# EAGLE board current stabiliser (EAGLE 8.3.2)
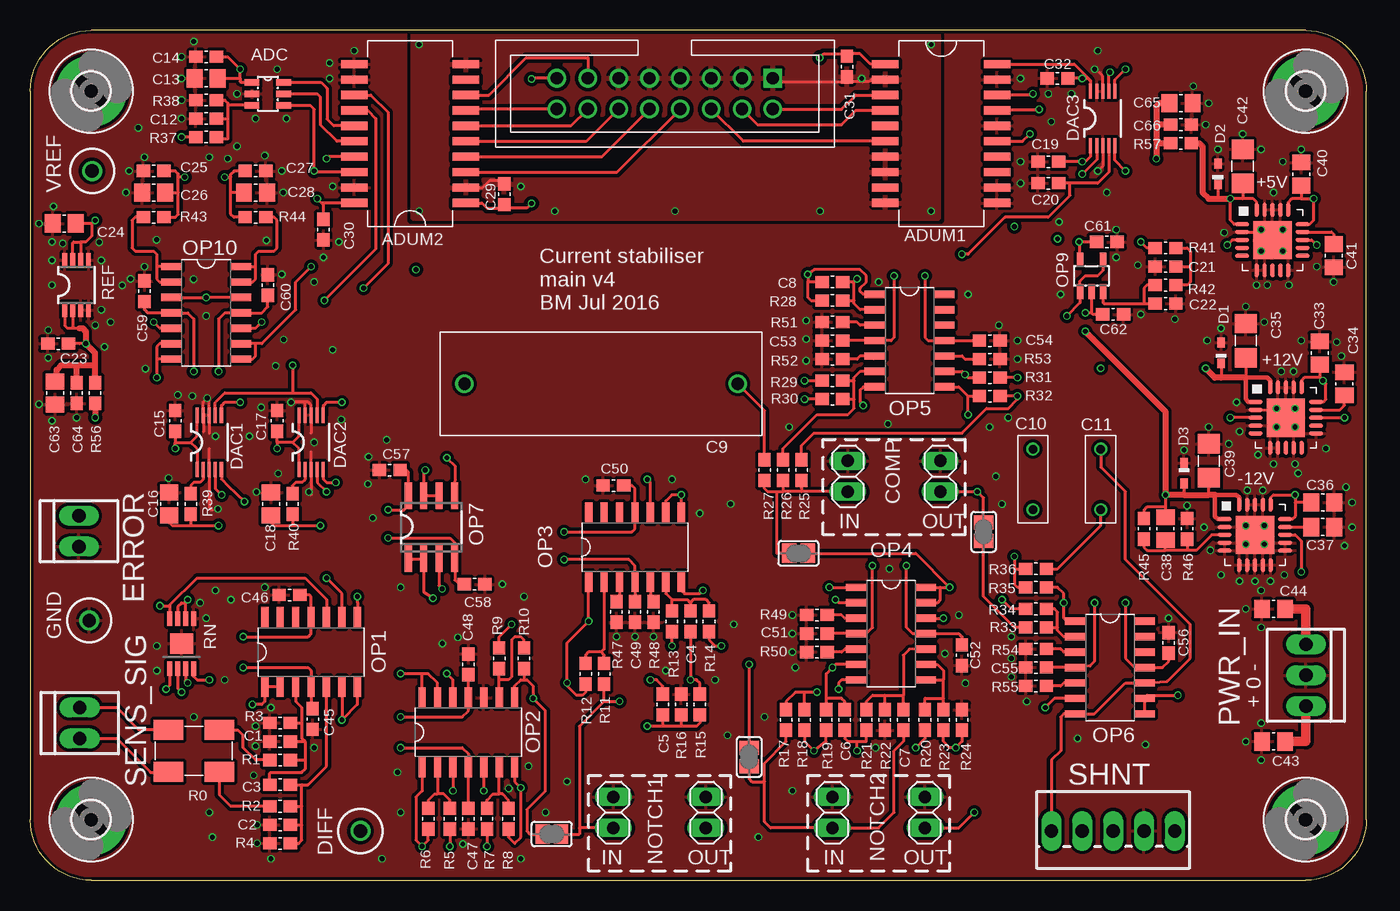
[diagram p12: board, top side]
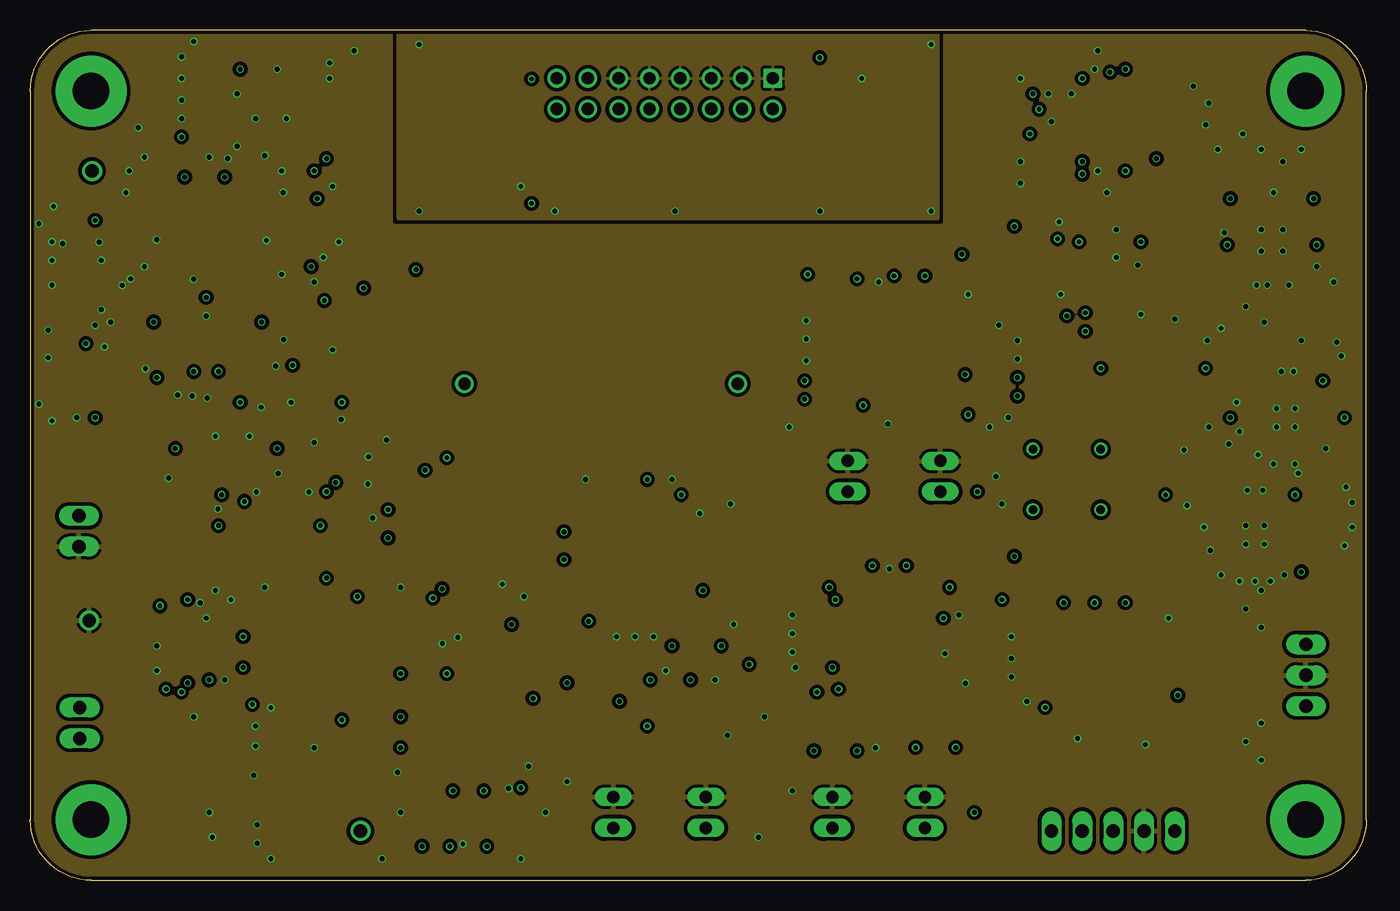
[diagram p13: board, inner layer ground]
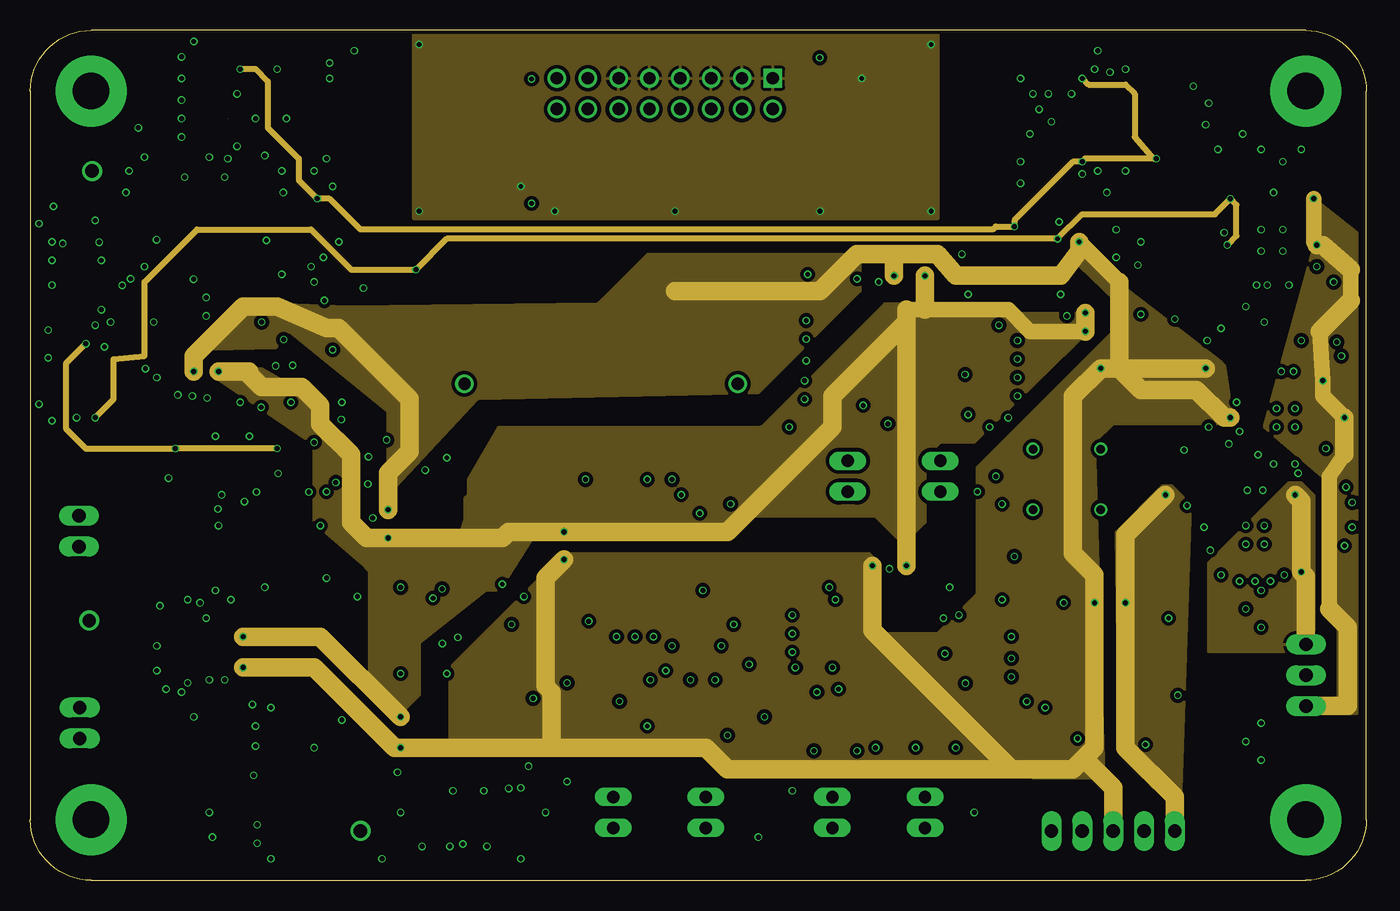
[diagram p14: board, inner layer power]
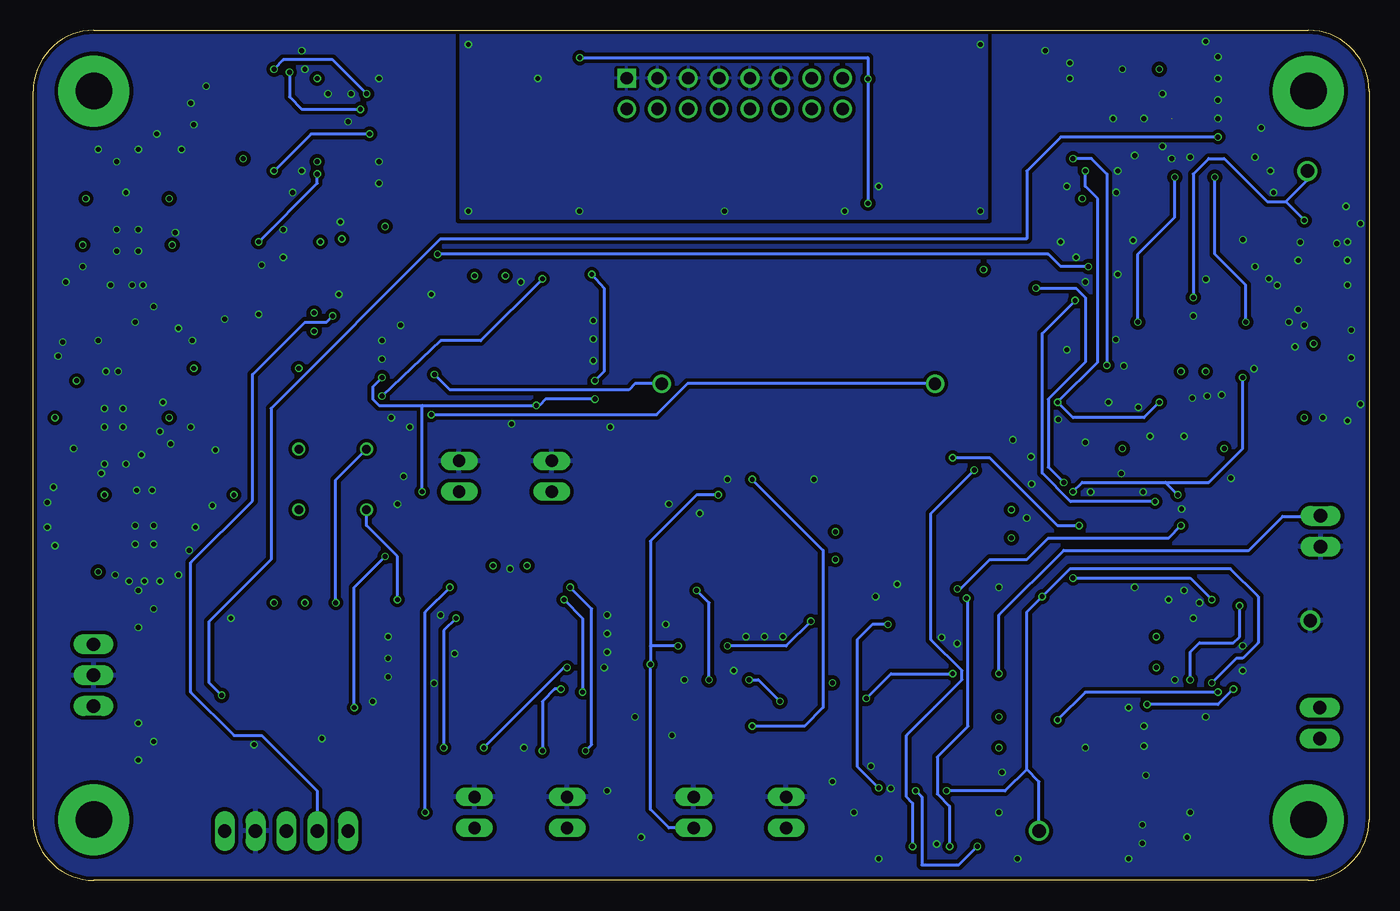
[diagram p15: board, bottom side, seen from below]

Size 110 x 70 mm. Coordinates in mm from the lower left corner, seen from the top.
Outline: 5,0 105,0 arc90 110,5 110,65 arc90 105,70 5,70 arc90 0,65 0,5 arc90 5,0
Copper layers (1*2*15*16): Top 0.035mm / dielectric 0.2mm / ground 0.0175mm / dielectric 0.3mm / power 0.0175mm / dielectric 0.2mm / Bottom 0.035mm
Design rules "SeeedStudio_4layer_DRU_no_angle_20140221": minimum track width 8mil, minimum drill 12mil, track to track 8mil, track to pad 8mil, pad to pad 8mil, via to via 8mil, smd to smd 0mil, copper to edge 10mil, drill to drill 8mil, minimum pad ring 6mil, minimum via ring 4mil, stop-mask expansion 4mil, vias tented up to drill 100mil, thermal gap 10mil

## Footprints (pad centres in the part's own frame; a part is rotated, then mirrored left to right if it is on the bottom)
QFN20_5 = smd 3.15 x 3.15: EP 0,0 | smd 1.175 x 0.35: P$1 -2.487,1.3; P$2 -2.487,0.65; P$3 -2.487,0; P$4 -2.487,-0.65; P$5 -2.487,-1.3; P$11 2.487,-1.3; P$12 2.487,-0.65; P$13 2.487,0; P$14 2.487,0.65; P$15 2.487,1.3 | smd 0.35 x 1.175: P$6 -1.3,-2.487; P$7 -0.65,-2.487; P$8 0,-2.487; P$9 0.65,-2.487; P$10 1.3,-2.487; P$16 1.3,2.487; P$17 0.65,2.487; P$18 0,2.487; P$19 -0.65,2.487; P$20 -1.3,2.487
SOT23-6 = smd 0.55 x 1.2: 1 -0.95,-1.3; 2 0,-1.3; 3 0.95,-1.3; 4 0.95,1.3; 5 0,1.3; 6 -0.95,1.3
SOIC_IC-20 = smd 2.2 x 0.6: 1 -4.6,5.715; 2 -4.6,4.445; 3 -4.6,3.175; 4 -4.6,1.905; 5 -4.6,0.635; 6 -4.6,-0.635; 7 -4.6,-1.905; 8 -4.6,-3.175; 9 -4.6,-4.445; 10 -4.6,-5.715; 11 4.6,-5.715; 12 4.6,-4.445; 13 4.6,-3.175; 14 4.6,-1.905; 15 4.6,-0.635; 16 4.6,0.635; 17 4.6,1.905; 18 4.6,3.175; 19 4.6,4.445; 20 4.6,5.715
0603 = smd 1.1 x 1: 1 -0.85,0; 2 0.85,0
CAP-26.5X8.5 = drill 1: P$1 -11.25,0; P$2 11.25,0
CAP-R82EC-7.2X2.5 = drill 0.7: P$1 -2.5,0; P$2 2.5,0
0805 = smd 1.3 x 1.5: 1 -0.95,0; 2 0.95,0
1206 = smd 1.6 x 1.8: 1 -1.4,0; 2 1.4,0
1X02 = drill 1.016 long: 1 -1.27,0; 2 1.27,0
SOD523 = smd 0.8 x 0.6: A 0.85,0; K -0.85,0
MSOP10_LONG = smd 0.25 x 1.25: 1 -1,-2.238; 2 -0.5,-2.238; 3 0,-2.238; 4 0.5,-2.238; 5 1,-2.238; 6 1,2.238; 7 0.5,2.238; 8 0,2.238; 9 -0.5,2.238; 10 -1,2.238
TESTPOINT = drill 1.1: P$1 0,0
MOLEX-2PIN = drill 1.1 long: 1 -1.27,0; 2 1.27,0
3,0-PAD = drill 3 pad 5.842: B3,0 0,0
SO14 = smd 1.7 x 0.6: P$1 -2.85,3.81; P$2 -2.85,2.54; P$3 -2.85,1.27; P$4 -2.85,0; P$5 -2.85,-1.27; P$6 -2.85,-2.54; P$7 -2.85,-3.81; P$8 2.85,-3.81; P$9 2.85,-2.54; P$10 2.85,-1.27; P$11 2.85,0; P$12 2.85,1.27; P$13 2.85,2.54; P$14 2.85,3.81
SO8 = smd 0.6 x 2.2: 1 -1.905,-2.6; 2 -0.635,-2.6; 3 0.635,-2.6; 4 1.905,-2.6; 5 1.905,2.6; 6 0.635,2.6; 7 -0.635,2.6; 8 -1.905,2.6
SOT23-5 = smd 0.55 x 1.2: 1 -0.95,-1.3; 2 0,-1.3; 3 0.95,-1.3; 4 0.95,1.3; 5 -0.95,1.3
MOLEX-3PIN = drill 1.1 long: 1 -2.54,0; 2 0,0; 3 2.54,0
VCS1625Z = smd 2.41 x 1.65: P$1 -2.095,1.715; P$2 -2.095,-1.715; P$3 2.095,1.715; P$4 2.095,-1.715
MSOP8 = smd 0.4 x 1.2: 1 -0.975,-2.05; 2 -0.325,-2.05; 3 0.325,-2.05; 4 0.975,-2.05; 5 0.975,2.05; 6 0.325,2.05; 7 -0.325,2.05; 8 -0.975,2.05
MSOP8-EP = smd 0.4 x 1.2: 1 -0.975,-2.05; 2 -0.325,-2.05; 3 0.325,-2.05; 4 0.975,-2.05; 5 0.975,2.05; 6 0.325,2.05; 7 -0.325,2.05; 8 -0.975,2.05 | smd 1.88 x 1.68: EP 0,0
MOLEX-KK-5PIN = drill 1.1 long: 1 -5.08,0; 2 -2.54,0; 3 0,0; 4 2.54,0; 5 5.08,0
SJ = smd 1.168 x 1.6: 1 -0.762,0; 2 0.762,0
HEADER-2X8-BOX = drill 1.02 square: 1 -8.89,-1.27 | drill 1.02: 2 -8.89,1.27; 3 -6.35,-1.27; 4 -6.35,1.27; 5 -3.81,-1.27; 6 -3.81,1.27; 7 -1.27,-1.27; 8 -1.27,1.27; 9 1.27,-1.27; 10 1.27,1.27; 11 3.81,-1.27; 12 3.81,1.27; 13 6.35,-1.27; 14 6.35,1.27; 15 8.89,-1.27; 16 8.89,1.27

## Placement (x,y rotation side)
+5V  TPS7A4700  [QFN20_5]  102.27,52.73 0 top
+12V  TPS7A4700  [QFN20_5]  103.38,38.1 0 top
-12V  TPS7A33  [QFN20_5]  100.84,28.45 0 top
ADC  AD7477SOT23  [SOT23-6]  19.56,64.77 270 top
ADUM1  ADUM4151B  [SOIC_IC-20]  75,61.5 0 top
ADUM2  ADUM4151B  [SOIC_IC-20]  31.27,61.5 180 top
C1  4n7  [0603]  20.57,11.43 180 top
C2  4n7  [0603]  20.57,4.57 180 top
C3  47n  [0603]  20.57,7.87 0 top
C4  1n5  [0603]  54.36,21.34 270 top
C5  1n5  [0603]  52.07,14.48 270 top
C6  1n0  [0603]  67.06,13.21 270 top
C7  10n  [0603]  71.88,13.21 90 top
C8  470n  [0603]  66.04,49.28 180 top
C9  10u  [CAP-26.5X8.5]  46.99,40.89 180 top
C10  68n  [CAP-R82EC-7.2X2.5]  82.55,33.02 90 top
C11  68n  [CAP-R82EC-7.2X2.5]  88.14,33.02 90 top
C12  27p  [0603]  14.48,62.74 180 top
C13  1u  [0805]  14.48,66.04 180 top
C14  100n  [0603]  14.48,67.82 180 top
C15  100n  [0603]  11.94,37.85 90 top
C16  10u  [0805]  11.43,30.99 90 top
C17  100n  [0603]  20.32,37.85 90 top
C18  10u  [0805]  19.81,30.99 90 top
C19  100n  [0603]  83.82,59.18 180 top
C20  100n  [0603]  83.82,57.4 180 top
C21  68n  [0603]  93.47,50.55 180 top
C22  68n  [0603]  93.47,47.5 0 top
C23  100n  [0603]  2.29,44.2 180 top
C24  10u  [0805]  2.79,54.1 180 top
C25  100n  [0603]  10.16,58.42 180 top
C26  10u  [0805]  10.16,56.64 180 top
C27  100n  [0603]  18.54,58.42 0 top
C28  10u  [0805]  18.54,56.64 0 top
C29  100n  [0603]  39.02,56.5 270 top
C30  100n  [0603]  24.13,53.59 270 top
C31  100n  [0603]  67.25,67.02 90 top
C32  100n  [0603]  84.58,66.04 180 top
C33  10u  [0805]  106.17,43.43 90 top
C34  1u  [0805]  108.2,40.89 90 top
C35  47u  [1206]  100.08,44.45 90 top
C36  10u  [0805]  106.43,31.11 0 top
C37  1u  [0805]  106.43,29.08 0 top
C38  10n  [0805]  93.47,28.96 270 top
C39  47u  [1206]  97.03,34.54 90 top
C40  10u  [0805]  104.65,58.17 90 top
C41  1u  [0805]  107.31,51.44 270 top
C42  47u  [1206]  99.82,58.8 90 top
C43  10u  [0805]  102.36,11.43 180 top
C44  10u  [0805]  102.36,22.35 180 top
C45  100n  [0603]  23.25,13.28 270 top
C46  100n  [0603]  21.34,23.5 180 top
C47  100n  [0603]  36.07,5.08 270 top
C48  100n  [0603]  36.07,17.78 90 top
C49  100n  [0603]  49.78,22.1 270 top
C50  100n  [0603]  48.01,32.51 180 top
C51  100n  [0603]  64.77,20.32 180 top
C52  100n  [0603]  76.71,18.54 270 top
C53  100n  [0603]  66.04,44.45 180 top
C54  100n  [0603]  78.99,44.45 0 top
C55  100n  [0603]  82.8,17.53 180 top
C56  100n  [0603]  93.73,19.56 90 top
C57  100n  [0603]  29.59,33.78 180 top
C58  100n  [0603]  36.58,24.38 0 top
C59  100n  [0603]  9.4,48.51 90 top
C60  100n  [0603]  19.56,49.02 90 top
C61  100n  [0603]  88.65,52.58 0 top
C62  100n  [0603]  89.15,46.61 0 top
C63  10u  [0805]  2.03,40.13 270 top
C64  100n  [0603]  3.81,40.13 270 top
C65  10u  [0805]  94.74,64.01 0 top
C66  100n  [0603]  94.74,62.23 0 top
COMP_IN  [1X02]  67.31,33.27 90 top
COMP_OUT  [1X02]  74.93,33.27 90 top
D1  DIODE_SCHOTTKY  [SOD523]  98.04,43.43 90 top
D2  DIODE_SCHOTTKY  [SOD523]  97.79,58.17 90 top
D3  DIODE_SCHOTTKY  [SOD523]  95,33.53 270 top
DAC1  AD5541A  [MSOP10_LONG]  14.73,36.07 0 top
DAC2  AD5541A  [MSOP10_LONG]  23.11,36.07 0 top
DAC3  AD5541A  [MSOP10_LONG]  88.3,62.75 0 top
DIFF  TESTPOINT  [TESTPOINT]  27.18,4.06 90 top
ERROR  MOLEX_SIG_2PIN  [MOLEX-2PIN]  4,28.75 90 top
GND  TESTPOINT  [TESTPOINT]  4.85,21.4 90 top
H1  MOUNT-PAD-ROUND3.0  [3,0-PAD]  5,5 0 top
H2  MOUNT-PAD-ROUND3.0  [3,0-PAD]  5,65 0 top
H3  MOUNT-PAD-ROUND3.0  [3,0-PAD]  105,5 0 top
H4  MOUNT-PAD-ROUND3.0  [3,0-PAD]  105,65 0 top
NOTCH1_IN  [1X02]  48.01,5.59 90 top
NOTCH1_OUT  [1X02]  55.63,5.59 90 top
NOTCH2_IN  [1X02]  66.04,5.59 90 top
NOTCH2_OUT  [1X02]  73.66,5.59 90 top
OP1  ADA4004-4  [SO14]  23.11,18.8 90 top
OP2  ADA4004-4  [SO14]  36.07,12.19 90 top
OP3  ADA4004-4  [SO14]  49.78,27.43 90 top
OP4  ADA4004-4  [SO14]  70.87,20.32 0 top
OP5  ADA4004-4  [SO14]  72.39,44.45 0 top
OP6  ADA4004-4  [SO14]  88.9,17.53 0 top
OP7  ADA4004-2  [SO8]  33.02,29.08 0 top
OP9  ADA4004-1  [SOT23-5]  87.38,49.78 0 top
OP10  ADA4004-4  [SO14]  14.48,46.74 0 top
PWR_IN  MOLEX_POWER_3PINKK  [MOLEX-3PIN]  105.03,16.89 270 top
R0  10R  [VCS1625Z]  13.46,10.67 0 top
R1  16R  [0603]  20.57,9.91 0 top
R2  16R  [0603]  20.57,6.1 0 top
R3  DNF  [0603]  20.57,12.95 0 top
R4  DNF  [0603]  20.57,3.05 0 top
R5  1k  [0603]  34.54,5.08 90 top
R6  100k  [0603]  32.77,5.08 270 top
R7  10k  [0603]  37.59,5.08 90 top
R8  10k  [0603]  39.37,5.08 270 top
R9  10k  [0603]  38.61,18.29 270 top
R10  10k  [0603]  40.64,18.29 270 top
R11  10k  [0603]  47.24,17.02 90 top
R12  10k  [0603]  45.72,17.02 270 top
R13  6k2  [0603]  52.83,21.34 90 top
R14  6k2  [0603]  55.88,21.34 270 top
R15  6k2  [0603]  55.12,14.48 270 top
R16  6k2  [0603]  53.59,14.48 90 top
R17  10k  [0603]  62.23,13.21 90 top
R18  10k  [0603]  63.75,13.21 270 top
R19  270R  [0603]  65.53,13.21 90 top
R20  9k1  [0603]  73.66,13.21 90 top
R21  3k6  [0603]  68.83,13.21 90 top
R22  3k6  [0603]  70.36,13.21 90 top
R23  10k  [0603]  75.18,13.21 270 top
R24  300R  [0603]  76.71,13.21 270 top
R25  2k4  [0603]  63.5,33.78 90 top
R26  430  [0603]  61.98,33.78 90 top
R27  13k  [0603]  60.45,33.78 90 top
R28  2k4  [0603]  66.04,47.75 180 top
R29  470  [0603]  66.04,41.15 0 top
R30  27k  [0603]  66.04,39.62 180 top
R31  13k  [0603]  78.99,41.4 180 top
R32  4k3  [0603]  78.99,39.88 0 top
R33  360R  [0603]  82.8,20.83 0 top
R34  2k2  [0603]  82.8,22.35 180 top
R35  2k7  [0603]  82.8,24.13 180 top
R36  680R  [0603]  82.8,25.65 0 top
R37  15k  [0603]  14.48,61.21 180 top
R38  7k5  [0603]  14.48,64.26 0 top
R39  1k  [0603]  13.21,30.99 270 top
R40  1k  [0603]  21.59,30.99 270 top
R41  680  [0603]  93.47,52.07 0 top
R42  1k2  [0603]  93.47,49.02 180 top
R43  100R  [0603]  10.16,54.61 180 top
R44  100R  [0603]  18.54,54.61 0 top
R45  1.5M  [0603]  91.69,28.96 90 top
R46  162k  [0603]  95.25,28.96 270 top
R47  2k7  [0603]  48.26,22.1 270 top
R48  2k7  [0603]  51.31,22.1 270 top
R49  2k7  [0603]  64.77,21.84 0 top
R50  2k7  [0603]  64.77,18.8 0 top
R51  2k7  [0603]  66.04,45.97 0 top
R52  2k7  [0603]  66.04,42.93 0 top
R53  2k7  [0603]  78.99,42.93 180 top
R54  10k  [0603]  82.8,19.05 0 top
R55  10k  [0603]  82.8,16 0 top
R56  10R  [0603]  5.33,40.13 90 top
R57  10R  [0603]  94.74,60.71 180 top
REF  LTC6655  [MSOP8]  3.81,49.02 0 top
RN  1k  [MSOP8-EP]  12.46,19.5 0 top
SENS_SIG  MOLEX_SIG_2PIN  [MOLEX-2PIN]  4.06,12.95 90 top
SHNT  MOLEX-KK-1X5  [MOLEX-KK-5PIN]  89.15,4.06 180 top
SJ1  [SJ]  42.93,3.81 0 top
SJ2  [SJ]  59.18,10.16 270 top
SJ3  [SJ]  63.25,26.92 180 top
SJ4  [SJ]  78.49,28.7 270 top
SPI_CON  SPI_FB  [HEADER-2X8-BOX]  52.25,64.79 180 top
VREF  TESTPOINT  [TESTPOINT]  5.08,58.42 90 top

## Tracks (layer width: path | path; a pad name or v marks a point on that pad's centre or on a via)
!CS_ADC
  Top 0.254: ADUM2.15 24.99,62.13 24.43,62.7 24.43,65.24 23.94,65.72 ADC.6
!CS_FB_COARSE  (via drill 0.4)
  Top 0.254: v17.63,31.19 16.3,32.46 15.73,33.04 DAC1.5 | ADUM2.14 27.78,63.41 28.45,62.74 28.45,51.99 v24.21,47.75
  Bottom 0.254: v17.63,31.19 24.59,31.19 26.92,33.53 26.92,45.03 v24.21,47.75
!CS_FB_FINE  (via drill 0.4)
  Top 0.254: ADUM2.13 28.04,64.67 29.46,63.25 29.46,50.8 v27.43,48.77 | DAC2.5 24.11,33.04 24.38,32.77 v25.15,32.77
  Bottom 0.254: v27.43,48.77 24.13,48.77 23.37,48.01 23.37,42.67 26.42,39.62 26.42,34.04 v25.15,32.77
!CS_FF  (via drill 0.4)
  Top 0.254: ADUM1.15 81.69,60.87 v82.3,61.47 | v90.17,58.42 89.3,59.29 DAC3.5
  Bottom 0.254: v82.3,61.47 87.12,61.47 v90.17,58.42
+3V3DIG  (via drill 0.4)
  Top 0.254: SPI_CON.15 41.33,66.06 v41.27,66 | ADUM1.1 69.18,67.22 68.33,68.07 67.45,68.07 C31.2 67,67.87 66.8,68.07 65.32,68.07 v65,67.75 | ADUM2.1 37.18,55.78 37.59,55.37 38.74,55.37 C29.2 39.3,55.37 40.89,55.37 v41.27,55.75
  Bottom 0.254: v41.27,55.75 v41.27,66 41.27,67.75 v65,67.75
+5V  (via drill 0.4)
  Top 0.254: +5V.P$3 98.96,52.73 v98.55,52.32 | +5V.P$1 99.13,54.03 98.81,54.36 v98.81,56.13 99.82,56.13 | +5V.P$20 100.97,55.87 100.71,56.13 99.82,56.13 | C42.1 99.82,56.13 | D2.K 97.79,56.13
  Top 0.508: R56.1 v5.33,38.1 | R57.1 96.27,60.71 96.52,60.45 96.52,56.64 97.03,56.13 97.79,56.13 v98.81,56.13
  power 0.508: v5.33,38.1 6.86,39.62 6.86,42.93 9.4,43.18 9.4,49.28 13.72,53.59 23.11,53.59 26.42,50.29 v31.75,50.29 34.29,52.83 v84.58,52.83 86.61,54.86 97.54,54.86 v98.81,56.13 99.31,55.63 99.31,53.09 v98.55,52.32
+5VDD_ISO  (via drill 0.4)
  Top 0.254: ADUM1.20 85.95,67.22 87.12,66.04 | DAC3.1 87.3,59.61 86.87,59.18 v86.61,59.18 C19.1 | 87.12,66.04 v86.61,66.04 C32.1 | 87.12,66.04 87.3,65.86 DAC3.10 | C13.1 17.27,66.04 | C30.1 24.13,55.63 24,55.75 | 24,55.75 v23.62,56.13 | 17.27,66.04 v17.27,66.8 16.26,67.82 C14.1 | ADUM2.20 24.04,55.78 24,55.75 | 17.27,66.04 17.27,65.79 17.34,65.72 ADC.1
  Top 0.508: C65.1 92.96,64.01 92.71,63.75 92.71,62.23 | 92.71,62.23 92.71,60.96 | 92.71,60.96 92.96,60.71 R57.2 | C66.1 92.71,62.23 | 92.71,60.96 v92.71,59.44
  power 0.508: v17.27,66.8 18.54,66.8 19.56,65.79 19.56,61.98 22.1,59.44 22.1,57.66 v23.62,56.13 24.64,56.13 27.18,53.59 79.25,53.59 79.5,53.85 v81.03,53.85 81.03,54.36 85.85,59.18 v86.61,59.18 86.87,59.44 92.46,59.44 | v86.61,66.04 87.12,65.53 90.17,65.53 90.93,64.77 90.93,61.21 92.46,59.44 | 92.46,59.44 v92.71,59.44
+5VDD_REF  (via drill 0.4)
  Top 0.254: v4.57,44.2 4.06,44.2 | 4.06,44.2 C23.1 | 4.11,44.24 4.06,44.2 | 13.21,36.07 13.73,35.54 DAC1.1 | 13.21,36.07 13.73,36.59 DAC1.10 | 21.59,36.07 22.11,36.59 DAC2.10 | 21.59,36.07 22.11,35.54 DAC2.1 | 21.59,36.07 20.32,36.07 | 20.32,36.07 v20.32,35.56 | v11.94,35.56 11.94,36.07 | 11.94,36.07 13.21,36.07 | 20.32,36.07 C17.1 | C15.1 11.94,36.07 | REF.1 2.83,45.68 3.05,45.47 3.56,45.47 | 3.56,45.47 4.06,45.47 | REF.2 3.48,45.54 3.56,45.47
  Top 0.508: R56.2 5.33,42.42 | 5.33,42.42 5.33,43.43 v4.57,44.2 4.57,45.21 4.32,45.47 4.06,45.47 | C63.1 2.03,41.4 2.16,41.53 2.16,42.04 2.54,42.42 3.81,42.42 | 3.81,42.42 5.33,42.42 | C64.1 3.81,42.42
  power 0.508: v20.32,35.56 v11.94,35.56 4.57,35.56 2.92,37.21 2.92,42.55 v4.57,44.2
+12V  (via drill 0.4)
  Top 0.254: C47.1 OP2.P$4 36.07,10.41 35.56,10.92 v30.48,10.92 | v29.46,30.52 30.77,30.52 31.14,30.89 OP7.8 31.14,33.63 30.93,33.84 C57.1 | v71.12,49.78 71.12,44.7 70.87,44.45 OP5.P$4 C53.1 66.84,44.45 | v87.63,22.86 87.63,18.03 87.26,17.66 OP6.P$4 C55.1 | v69.34,25.91 69.34,20.83 68.81,20.29 OP4.P$4 C51.1 | C35.1 100.08,41.4 | +12V.P$3 v98.81,38.1 | C45.1 23.11,14.26 OP1.P$4 23.11,17.27 22.86,17.53 v17.53,17.53 | v43.94,26.42 49.28,26.42 49.78,25.91 OP3.P$4 C49.1 | C61.1 v86.36,52.58 86.43,52.51 OP9.5 | D1.K 98.04,41.4 | C59.1 9.4,46.99 9.65,46.74 OP10.P$4 12.95,46.74 13.46,46.23 v13.46,41.91
  Top 0.381: +12V.P$20 102.08,41.18 101.85,41.4 100.08,41.4 100.08,39.62 100.3,39.4 +12V.P$1
  Top 0.508: 100.08,41.4 98.04,41.4 97.52,41.4 v96.77,42.16
  power 1.27: 89.66,49.28 v86.36,52.58
  power 1.524: 80.77,9.14 69.34,20.57 v69.34,25.91 | 80.77,9.14 85.85,9.14 86.74,10.03 | 86.74,10.03 87.63,10.92 v87.63,22.86 87.63,25.15 85.85,26.92 85.85,39.88 v88.14,42.16 89.66,42.16 | 42.93,10.92 v30.48,10.92 29.97,10.92 23.37,17.53 v17.53,17.53 | 42.93,10.92 55.63,10.92 57.4,9.14 80.77,9.14 | v43.94,26.42 42.42,24.89 42.42,16 42.93,15.49 42.93,10.92 | v86.36,52.58 86.36,51.79 86.33,51.79 84.84,49.78 76.2,49.78 74.68,51.56 71.12,51.56 | 53.09,48.51 65.02,48.51 68.07,51.56 71.12,51.56 | v96.77,42.16 89.66,42.16 | 89.66,49.28 89.66,42.16 | v98.81,38.1 98.3,38.1 96.01,40.39 91.44,40.39 89.66,42.16 | SHNT.3 89.15,7.62 86.74,10.03 | v71.12,49.78 71.12,51.56 | v13.46,41.91 13.46,43.18 17.53,47.24 20.32,47.24 24.38,45.47 25.4,45.47 31.24,39.62 31.24,35.31 29.46,33.53 v29.46,30.52
  pour power (isolate 0.305): 85.85,52.07 98.04,42.67 98.3,42.42 99.06,37.59 89.15,37.59 87.63,36.07 88.39,8.38 82.55,8.38 69.6,20.32 74.68,20.32 77.98,23.62 77.98,34.04 90.42,46.48 90.42,46.74 85.34,51.56
  pour power (isolate 0.305): 43.94,26.92 69.09,26.92 69.85,26.16 69.85,20.07 80.26,9.65 80.77,9.14 57.4,9.14 55.63,10.92 34.54,10.92 34.54,17.53
  pour power (isolate 0.305): 13.21,43.69 16.51,46.99 19.81,47.5 26.16,47.24 46.74,47.5 50.8,51.56 68.33,51.56 68.33,48.51 59.94,40.13 36.83,39.62 29.46,31.75 29.46,38.61 21.34,45.21 20.19,43.81
+15V  (via drill 0.4)
  Top 0.254: +5V.P$15 105.34,54.03 105.66,54.36 v105.66,56.13 104.65,56.13 | +5V.P$13 105.51,52.73 v105.92,52.32 | 104.65,56.13 103.89,56.13 103.57,55.82 +5V.P$16 | C40.1 104.65,56.13 | +12V.P$15 106.46,39.4 106.68,39.62 106.68,40.89 v106.43,41.15 106.17,41.4 | 106.17,41.4 104.9,41.4 104.68,41.18 +12V.P$16 | +12V.P$13 v108.2,38.1 | C33.1 106.17,41.4
  Top 0.762: PWR_IN.3 105.03,11.43 C43.1
  power 1.27: v108.2,38.1 106.43,39.88 v106.43,41.15 106.17,45.21 | v105.66,56.13 105.66,52.58 v105.92,52.32 | 106.93,22.35 106.93,33.27 108.2,35.05 | 108.71,50.29 108.71,47.75
  power 1.524: 106.93,22.35 108.46,20.83 108.46,14.35 PWR_IN.3 | 108.2,35.05 v108.2,38.1 | v105.92,52.32 106.43,52.32 108.71,50.29 | 108.71,47.75 106.17,45.21
  pour power (isolate 0.305): 105.66,52.07 105.66,56.13 109.22,53.34 109.22,13.72 107.7,13.72 107.7,21.84 106.68,22.86 106.68,33.02 101.6,37.34
-12V  (via drill 0.4)
  Top 0.254: 36,16.92 C48.1 OP2.P$11 36.07,13.97 35.56,13.46 v30.48,13.46 | v29.46,28.19 34.54,28.19 34.95,27.79 OP7.4 34.95,24.74 35.28,24.41 C58.1 | v73.66,49.78 73.66,44.7 73.91,44.45 OP5.P$11 C54.1 | v90.17,22.86 90.17,18.29 90.8,17.66 OP6.P$11 93.22,17.53 93.73,18.03 C56.1 | v72.14,25.91 72.14,20.83 72.64,20.32 OP4.P$11 76.45,20.32 76.71,20.07 C52.1 | OP9.2 87.38,46.74 | 87.38,46.74 v86.87,46.74 | C62.1 87.5,46.61 87.38,46.74 | C46.1 22.99,23.5 23.11,23.37 OP1.P$11 23.11,20.32 22.86,20.07 v17.53,20.07 | v43.94,28.7 49.53,28.7 49.78,28.96 OP3.P$11 49.78,32.26 49.53,32.51 C50.1 | 97.03,31.75 C39.1 | D3.A 95,31.75 | 93.47,30.73 91.95,30.73 91.69,30.48 R45.2 | v93.47,31.75 93.47,30.73 | 93.47,30.73 C38.1 | C60.1 19.56,47.24 19.05,46.74 OP10.P$11 16,46.74 15.49,46.23 v15.49,41.91
  Top 0.381: -12V.P$20 99.54,31.53 99.31,31.75 97.54,31.75 97.54,29.97 97.76,29.75 -12V.P$1
  Top 0.508: 97.54,31.75 97.03,31.75 95,31.75 v93.47,31.75 93.47,38.61 v86.87,45.21
  power 1.27: v86.87,45.21 82.3,45.21 80.52,46.99 73.66,46.99 72.14,46.99
  power 1.524: v93.47,31.75 90.17,28.45 v90.17,22.86 90.17,10.92 94.23,6.86 SHNT.1 | v30.48,13.46 23.88,20.07 v17.53,20.07 | 72.14,45.97 66.04,39.88 66.04,37.34 57.4,28.7 v43.94,28.7 39.37,28.7 38.86,28.19 v29.46,28.19 27.69,28.19 26.42,29.46 26.42,35.05 23.88,37.59 23.88,39.12 22.35,40.64 19.05,40.64 18.03,41.66 18.03,41.91 v15.49,41.91 | v72.14,25.91 72.14,45.97 | v86.87,45.21 v86.87,46.74 | v73.66,49.78 73.66,46.99 | 72.14,45.97 72.14,46.99
  pour power (isolate 0.305): 93.22,32.51 93.98,32.51 95.5,30.99 94.74,7.37 92.46,7.62 89.66,10.67 89.41,28.7
  pour power (isolate 0.305): 15.24,41.4 15.75,42.42 19.05,42.16 23.11,39.88 23.11,38.61 26.92,34.8 26.92,29.46 28.19,28.19 35.31,28.19 36.58,32 38.1,24.38 32,19.56 32,15.24 30.48,13.72 29.97,13.72 27.94,15.75 27.94,25.4 27.18,26.16 23.37,29.46 23.37,35.81 23.11,36.07
  pour power (isolate 0.305): 36.07,31.75 36.07,33.02 38.61,37.34 60.2,37.34 70.36,47.5 80.01,47.5 80.77,46.74 86.87,46.74 86.87,44.96 85.85,43.94 77.72,36.07 74.93,36.07 73.66,34.8 73.66,29.46 72.39,28.19 71.37,28.19 69.6,29.97 58.42,29.97 57.15,28.7 41.66,28.7 38.61,23.88 36.07,23.88 35.81,24.13 35.81,31.5
-15V  (via drill 0.4, 0.4 pad 0.4)
  Top 0.254: -12V.P$16 102.14,31.53 102.36,31.75 v104.14,31.75 104.14,31.11 | 104.14,31.11 104.14,29.97 103.92,29.75 -12V.P$15 | C36.1 104.14,31.11 | -12V.P$13 104.14,28.45 104.65,27.94 v104.65,25.4
  Top 0.762: PWR_IN.1 105.03,22.35 C44.1
  power 1.524: v104.14,31.75 104.65,31.24 v104.65,25.4 105.03,25.02 PWR_IN.1
  pour power (isolate 0.305): 103.63,32.77 104.65,32.77 105.66,31.75 105.66,18.8 97.03,18.8 97.03,26.16
COMP  (via drill 0.4)
  Top 0.254: v81.28,41.4 80.26,41.41 R31.1 | OP5.P$7 68.58,40.64 68.33,40.39 68.33,39.37 v68.58,39.12 | R30.2 v63.75,39.62 | COMP_OUT.1 v77.98,32 78.49,31.5 SJ4.1
  Bottom 0.254: v63.75,39.62 67.82,39.62 68.33,39.12 v68.58,39.12 77.98,39.12 | 77.98,39.12 81.53,39.12 82.04,39.62 82.04,40.64 v81.28,41.4 | v77.98,32 77.98,39.12
DGND  (via drill 0.4)
  Top 0.254: ADUM1.2 69.25,65.94 69.09,65.79 67.63,65.79 C31.1 66.87,65.79 61.41,65.79 SPI_CON.1 | ADUM2.2 37.24,57.05 37.85,57.66 38.61,57.66 38.92,57.35 C29.1
  other vias: 32,68.83 32,55.12 74.17,55.12 74.17,68.83 43.18,55.12 53.09,55.12 65.02,55.12 40.39,57.15 68.45,66.04
  pour Top (isolate 0.305, rank 3): 31.52,70 74.75,70 74.75,54.5 31.52,54.5
  pour power (isolate 0.305): 31.52,54.5 74.75,54.5 74.75,70 31.52,70
  pour Bottom (isolate 0.305): 31.52,70 31.52,54.5 74.75,54.5 74.75,70
  pour ground (isolate 0.305): 30.25,70 30.25,54.5 74.75,54.5 74.75,70
DIFF_SIG  (via drill 0.4)
  Top 0.254: OP2.P$3 v34.8,7.37 | 26.93,22.87 26.92,22.86 | RN.3 12.79,16.43 v12.95,16.26 | 26.93,22.87 26.93,21.66 OP1.P$8 | v26.92,23.37 26.92,22.88 26.93,22.87
  Bottom 0.254: v12.95,16.26 10.92,18.29 10.41,18.29 9.14,19.56 9.14,23.37 11.43,25.65 24.64,25.65 v26.92,23.37 28.19,22.1 28.19,9.14 | DIFF.P$1 27.18,8.13 28.19,9.14 | 28.19,9.14 29.97,7.37 v34.8,7.37
DIG_FF_CLK
  Top 0.254: SPI_CON.2 61.14,63.5 66.8,63.5 67.98,64.67 ADUM1.3
DIG_FF_CS
  Top 0.254: ADUM1.6 58.72,60.87 SPI_CON.6
DIG_FF_SIG
  Top 0.254: SPI_CON.4 59.89,62.23 66.8,62.23 67.98,63.41 ADUM1.4
ERR  (via drill 0.4)
  Top 0.254: OP2.P$8 39.75,15.1 39.89,15.24 39.89,16.01 40.39,16.51 40.64,16.51 | OP2.P$12 34.8,16.51 v34.29,17.02 | R10.2 40.64,16.51 | 40.64,16.51 40.89,16.51 41.4,16 v41.4,14.99 42.42,13.97 42.42,7.37 40.89,5.84 40.89,4.06 41.15,3.81 SJ1.1
  Bottom 0.254: v41.4,14.99 39.37,17.02 v34.29,17.02
GND  (via drill 0.4)
  Top 0.25: 14.26,38.44 14.26,36.95
  Top 0.254: +5V.P$2 102.03,53.38 102.29,53.23 102.27,53.23 +5V.EP | 12.79,19.5 RN.EP | +12V.P$2 103.54,38.8 +12V.EP | DAC3.8 88.3,66.2 88.01,66.55 | DAC3.3 88.3,58.83 v87.88,58.42 | 22.61,39.37 22.86,39.37 23.11,39.12 DAC2.8 23.11,36.83 | 22.61,39.37 v21.46,39.37 | DAC1.9 14.23,39.38 14.48,39.62 | DAC2.9 22.61,39.36 22.61,39.37 | 14.73,39.62 DAC1.8 14.73,36.83 | DAC1.3 14.73,35.56 | DAC1.3 14.73,33.02 | 23.11,35.31 DAC2.3 23.11,31.75 | DAC1.3 14.73,30.73 14.99,30.48
  other vias: 84.84,48.26 29.34,36.27 13.44,49.5 20.85,44.53 13.34,39.88 27.79,32.64 28.19,29.84 81.53,59.18 14.73,5.59 18.39,8.64 23.37,10.92 30.23,8.89 28.96,1.78 40.39,1.78 41.02,9.4 8.89,61.98 40.64,23.37 76.99,16.23 62.99,17.53 62.48,37.34 70.61,37.59 79.5,33.27 51.31,20.07 70.74,25.65 30.48,24.13 57.66,30.99 24.89,57.15 101.6,45.97 1.91,55.5 81.53,66.04 87.88,68.33 81.53,57.4 91.19,50.67 91.44,46.61 99.31,39.37 16.26,59.44 17.02,64.77 13.46,69.09 12.45,62.74 12.45,64.26 12.45,66.04 12.45,67.82 24.64,67.31 24.64,66.04 26.67,68.33 0.71,54.08 10.39,52.76 14.55,39.73 12.14,39.98 25.6,37.95 19,38.96 11.38,33.12 15.44,30.58 18.62,31.98 20.4,33.5 22.94,31.98 9.47,42.14 23.37,49.28 25.4,52.58 19.3,59.69 20.83,56.64 21.08,62.74 24.89,43.69 10.41,17.27 16,16.51 13.46,13.46 15.24,23.88 14.48,21.59 16.51,23.11 19.3,24.13 35.61,2.99 44.2,8.13 39.38,7.56 42.42,5.59 30.48,5.59 35.19,20.01 33.92,19.5 49.78,20.07 48.26,20.07 45.72,33.02 52.83,33.02 55.12,30.23 57.91,21.08 52.32,17.27 56.39,16.51 59.94,3.56 57.4,11.94 62.74,7.37 60.45,13.46 81.28,42.93 81.28,44.45 79.76,45.72 80.52,38.1 78.99,37.34 38.86,24.38 77.22,48.26 69.85,49.28 63.88,46.1 63.88,44.58 63.88,42.8 80.01,30.98 80.77,18.28 80.77,20.06 80.77,16.76 82.04,14.73 91.82,11.17 93.73,21.59 98.04,25.15 108.84,31.11 108.84,29.08 99.57,24.64 100.84,24.64 103.25,25.15 96.65,29.08 97.16,27.18 100.2,32.13 101.47,32.13 104.39,33.53 106.68,35.56 99.57,36.96 107.95,43.18 104.65,44.45 96.9,44.45 95,35.43 97.03,37.34 95.25,30.86 85.72,64.77 87.63,66.8 97.79,60.2 99.82,61.47 98.3,53.34 100.97,49.02 101.85,49.02 103.63,49.02 102.36,56.64 104.65,60.2 107.31,49.28 100.08,47.24 84.07,62.48 89.41,53.59 88.65,56.64 94.23,46.23 84.71,54.23 69.6,10.92 75.31,18.67 76.45,21.84 62.74,21.84 62.74,20.32 62.74,18.8 10.41,19.3 7.57,49 5.66,52.55 5.84,51.05 14.48,46.48 27.84,34.88 1.47,43.03 17.02,60.45 14.73,59.56 20.32,66.8 18.54,62.74 9.4,59.56 20.7,49.91 18.03,36.58 15.24,36.58 23.37,36.07 19.81,14.22 19.81,1.78 14.99,3.56 103.12,51.82 103.12,53.59 101.35,53.59 101.35,51.82 102.62,38.86 104.14,38.86 104.14,37.34 102.62,37.34 101.6,29.21 101.6,27.69 100.08,27.69 100.08,29.21 18.54,12.7 18.54,11.05 18.67,4.57 18.67,3.05 107.57,44.32 105.92,50.55 103.12,59.18 102.11,24.64 101.09,35.05 108.33,32.38 1.78,52.58 3.81,38.1 1.78,37.85 89.41,51.31 108.2,27.56 97.03,64.01 96.77,62.23 95.76,65.41 86.23,11.68 100.08,11.43 101.35,9.9 101.35,12.95 101.35,20.82 100.08,22.35 101.35,23.87 98.68,35.94 98.04,45.47 83.82,64.77 13.97,22.86 7.87,56.64 9.4,50.55 6.1,43.94 24.13,51.31 20.7,58.42 8.13,58.42 8.26,49.53 20.19,42.37 6.6,45.97 1.47,45.31 0.71,39.22 19.43,52.7 101.35,60.2 102.36,34.29 104.14,34.29 104.01,41.91 103,41.91 1.78,51.05 5.84,46.99 5.33,45.72 2.67,52.45 1.78,49.02
  pour ground (isolate 0.305, rank 5): 0,70 110,70 110,0 0,0
  pour Bottom (isolate 0.305, rank 5): 0,70 110,70 110,0 0,0
  pour Top (isolate 0.27, rank 5): 0,70 110,70 110,0 0,0
N$1
  Top 0.254: SENS_SIG.2 7.11,14.22 8.89,12.45 11.3,12.45 R0.P$1
N$3
  Top 0.254: R4.2 22.1,3.05 22.35,3.3 22.35,4.57 | 22.35,4.57 22.35,6.1 | 22.35,6.1 22.35,7.87 | C3.2 22.35,7.87 | 22.35,7.87 22.86,7.87 24.38,9.4 OP1.P$5 | R2.2 22.35,6.1 | C2.1 22.35,4.57
N$4
  Top 0.254: R0.P$4 15.56,7.05 16.51,6.1 R2.1
N$5
  Top 0.254: R0.P$3 17.08,12.38 17.53,11.94 17.53,10.92 18.54,9.91 R1.1
N$6
  Top 0.254: 22.61,11.43 22.61,9.91 | 22.61,9.91 22.61,9.14 22.35,8.89 19.81,8.89 19.72,8.8 C3.1 | R3.2 22.35,12.95 | 22.61,11.43 22.35,11.68 22.35,12.95 | 22.35,12.95 22.35,14.22 21.84,14.73 OP1.P$3 | C1.1 22.61,11.43 | R1.2 22.61,9.91
N$7  (via drill 0.4)
  Top 0.254: OP1.P$2 OP1.P$1 19.3,14.73 19.05,14.48 v18.29,14.48 | RN.1 11.48,16.06 v11.18,15.75
  Bottom 0.254: v18.29,14.48 12.45,14.48 v11.18,15.75
N$8  (via drill 0.4)
  Top 0.254: RN.2 12.13,15.8 v12.45,15.49 | OP1.P$6 v25.65,13.21 26.92,14.48 OP1.P$7
  Bottom 0.254: v12.45,15.49 23.37,15.49 v25.65,13.21
N$9  (via drill 0.4)
  Top 0.254: 11.48,22.61 RN.8 | v10.67,22.61 11.48,22.61 | RN.4 13.44,16.79 13.72,16.51 v14.73,16.51 | 11.48,22.61 11.48,22.66 13.72,24.89 22.61,24.89 24.38,23.11 OP1.P$10
  Bottom 0.254: v14.73,16.51 14.73,18.8 13.97,19.56 11.18,19.56 10.67,20.07 v10.67,22.61
N$10
  Top 0.254: 33.54,9.4 OP2.P$2 33.53,7.11 | R6.1 32.77,6.6 33.27,7.11 33.53,7.11 | R5.2 34.54,6.6 34.04,7.11 33.53,7.11
N$11  (via drill 0.4)
  Top 0.254: RN.7 12.13,22.55 12.45,22.86 12.7,22.86 v12.95,23.11 12.79,22.95 RN.6 | OP1.P$9 25.65,23.62 v24.38,24.89
  Bottom 0.254: v24.38,24.89 14.73,24.89 v12.95,23.11
N$12
  Top 0.254: 38.54,17.04 R9.2 38.61,16.51 | OP2.P$9 38.61,16.51 | R10.1 40.64,19.81 40.39,20.07 39.88,20.07 39.62,19.81 39.62,16.76 39.37,16.51 38.61,16.51
N$13  (via drill 0.4)
  Top 0.254: OP2.P$5 v37.34,7.37 | OP2.P$1 32.26,7.37 31.75,6.86 31.75,3.3 v32.26,2.79 32.77,3.3 R6.2
  Bottom 0.254: v37.34,7.37 36.83,6.86 36.83,1.27 33.78,1.27 v32.26,2.79
N$14
  Top 0.254: R7.2 37.59,6.6 38.1,7.11 38.61,7.11 | 38.61,7.11 OP2.P$6 | R8.1 39.37,6.6 38.86,7.11 38.61,7.11
N$15  (via drill 0.4)
  Top 0.254: R8.2 39.37,3.56 39.88,3.05 40.39,3.56 v40.39,7.62 39.88,8.13 OP2.P$7 | R9.1 38.61,20.07 v39.62,21.08
  Bottom 0.254: v39.62,21.08 40.89,21.08 42.16,19.81 42.16,9.4 v40.39,7.62
N$16
  Top 0.254: 47.06,24.63 OP3.P$2 47.24,19.05 46.99,18.8 | R12.1 45.72,18.54 45.97,18.8 46.99,18.8 | R11.2 47.24,18.54 46.99,18.8
N$17  (via drill 0.4)
  Top 0.254: 45.97,24.63 OP3.P$1 v45.97,21.34 44.2,19.56 v44.2,16.26 44.2,16 44.96,15.24 45.47,15.24 45.72,15.49 R12.2 | v52.83,19.3 R13.1
  Bottom 0.254: v45.97,21.34 48.01,19.3 v52.83,19.3
N$18  (via drill 0.4)
  Top 0.254: OP2.P$13 33.53,16.26 32.77,17.02 32.26,17.02 | 32.26,17.02 v30.48,17.02 | OP2.P$14 32.26,17.02
  Bottom 0.254: v30.48,17.02 30.48,21.84 25.15,27.18 9.91,27.18 7.11,29.97 4.05,29.97 ERROR.2
N$19
  Top 0.254: OP3.P$6 52.32,23.62 52.83,23.11 | 52.83,23.11 54.1,23.11 54.36,22.86 | 54.36,22.86 C4.1 | R13.2 52.83,23.11 | R14.1 55.88,22.86 55.63,23.11 54.61,23.11 54.36,22.86
N$20  (via drill 0.4)
  Top 0.254: 54.14,20.83 C4.2 v54.36,16.51 54.86,16.51 55.12,16.26 R15.1 | OP3.P$7 53.59,23.88 53.85,23.62 55.12,23.62 v55.37,23.88
  Bottom 0.254: v54.36,16.51 54.36,22.86 v55.37,23.88
N$21  (via drill 0.4)
  Top 0.254: OP4.P$2 66.55,22.86 v66.29,23.11 | v64.77,15.49 63.75,15.49 | 63.75,15.49 62.99,15.49 62.23,14.73 R17.2 | R18.1 63.75,15.49
  Bottom 0.254: v66.29,23.11 64.77,21.59 v64.77,15.49
N$22  (via drill 0.4)
  Top 0.254: OP3.P$10 51.05,32.77 v50.8,33.02 | R15.2 55.12,12.95 54.86,12.7 53.59,12.7 | 53.59,12.7 52.07,12.7 | 52.07,12.7 v50.8,12.7 | C5.2 52.07,12.7 | R16.1 53.59,12.7
  Bottom 0.254: v50.8,33.02 44.96,27.18 44.96,14.22 46.48,12.7 v50.8,12.7
N$23  (via drill 0.4)
  Top 0.254: R19.1 65.52,11.43 v64.52,10.67 63.75,11.43 R18.2 | 65.79,24.1 v65.79,24.13 OP4.P$1
  Bottom 0.254: v64.52,10.67 64.01,11.18 64.01,22.35 v65.79,24.13
N$24  (via drill 0.4)
  Top 0.254: R19.2 65.53,14.99 | 65.53,14.99 65.53,17.02 v66.04,17.53 66.29,17.78 OP4.P$6 | C6.1 67.06,14.73 66.8,14.99 65.53,14.99 | R20.1 73.66,11.68 v72.9,10.92
  Bottom 0.254: v66.04,17.53 66.29,17.53 v72.9,10.92
N$25
  Top 0.254: OP4.P$10 72.36,19.02 71.88,18.54 71.88,15.24 | 70.36,15.24 69.34,15.24 68.83,14.73 R21.2 | 70.36,15.24 71.88,15.24 | C7.2 71.88,15.24 | R22.2 70.36,15.24
N$26  (via drill 0.4)
  Top 0.254: C6.2 67.06,11.68 67.31,11.43 68.07,11.43 | 68.07,11.43 68.83,11.43 R21.1 | OP4.P$7 66.8,16.51 66.55,16.26 v66.55,15.75 | v68.07,10.67 68.07,11.43
  Bottom 0.254: v66.55,15.75 67.06,15.75 68.07,14.73 v68.07,10.67
N$27
  Top 0.254: OP4.P$9 74.68,17.78 75.18,17.27 75.18,16.51 | OP4.P$8 75.18,16.51 | R23.1 75.18,14.99 | R20.2 73.66,14.99 75.18,14.99 | 75.18,14.99 75.18,16.51
N$28  (via drill 0.4)
  Top 0.254: OP4.P$12 v75.18,21.59 | R24.2 76.71,11.43 v76.2,10.92 75.69,10.92 75.18,11.43 R23.2
  Bottom 0.254: v75.18,21.59 76.2,20.57 v76.2,10.92
N$29  (via drill 0.4)
  Top 0.254: R32.2 v81.28,39.88 81.28,39.62 80.52,38.86 78.74,38.86 76.71,36.83 64.52,36.83 63.5,35.81 R25.2 | OP5.P$2 68.33,46.99 67.82,47.5 67.82,47.75 | 67.82,47.75 67.82,49.28 | 67.82,49.28 C8.1 | v68.07,49.53 67.82,49.28 | R28.1 67.82,47.75
  Bottom 0.254: v68.07,49.53 73.15,44.45 76.45,44.45 v81.28,39.88
N$30
  Top 0.254: OP5.P$6 68.33,41.91 67.82,41.4 67.82,41.15 | R30.1 67.82,39.62 | 67.82,39.62 67.82,38.86 67.31,38.35 64.77,38.35 61.98,35.56 R26.2 | 67.82,39.62 67.82,41.15 | R29.2 67.82,41.15
N$31  (via drill 0.4)
  Top 0.254: 77.98,41.41 R31.2 77.22,41.4 v76.96,41.66 76.71,41.91 OP5.P$9 | R27.2 60.45,38.68 C9.P$1
  Bottom 0.254: C9.P$1 60.45,40.89 60.96,40.39 75.69,40.39 v76.96,41.66
N$32  (via drill 0.4)
  Top 0.254: v63.75,41.15 R29.1 | OP5.P$1 68.58,48.26 68.33,48.51 68.33,48.77 68.83,49.28 68.83,49.78 68.33,50.29 64.52,50.29 v64.01,49.91 64.01,49.28 | R28.2 64.26,47.75 64.01,48.01 64.01,49.28 | C8.2 64.01,49.28
  Bottom 0.254: v64.01,49.91 62.99,48.77 62.99,41.91 v63.75,41.15
N$33
  Top 0.254: OP6.P$2 85.09,20.07 84.58,20.57 84.58,20.83 | R33.2 84.58,20.83 | 84.58,20.83 84.58,22.1 84.33,22.35 R34.1
N$34
  Top 0.254: OP6.P$3 85.09,18.8 84.84,19.05 R54.2
N$35  (via drill 0.4)
  Top 0.254: OP5.P$8 76.45,40.64 77.22,39.88 | 77.22,39.88 R32.1 | v77.22,38.35 77.22,39.88
  Bottom 0.254: v77.22,38.35 58.67,38.35 56.13,40.89 C9.P$2
N$36
  Top 0.254: OP6.P$5 85.09,16.26 84.84,16 R55.2
N$37  (via drill 0.4)
  Top 0.254: OP6.P$6 84.33,14.99 v83.57,14.22 | R35.2 81.28,24.13 81.03,24.38 81.03,25.65 | 81.03,25.65 R36.1 | v81.03,26.67 81.03,25.65
  Bottom 0.254: v83.57,14.22 83.57,24.13 v81.03,26.67
N$38
  Top 0.254: R36.2 84.58,25.65 88.14,29.21 C11.P$1
N$39  (via drill 0.4)
  Top 0.254: R34.2 80.77,22.35 v80.01,23.11
  Bottom 0.254: v80.01,23.11 80.01,26.67 82.55,29.21 C10.P$1
N$40  (via drill 0.4)
  Top 0.254: OP6.P$1 85.34,21.34 85.09,21.59 v85.09,22.86 85.09,23.62 84.58,24.13 R35.1
  Bottom 0.254: v85.09,22.86 85.09,32.98 C10.P$2
N$43  (via drill 0.4)
  Top 0.254: OP6.P$8 OP6.P$9 91.96,15.24 v94.49,15.24 | R37.2 v12.45,61.21
  Bottom 0.254: v12.45,61.21 25.4,61.21 28.19,58.42 28.19,52.83 76.45,52.83 90.42,38.86 90.42,26.42 95.5,21.34 95.5,16.26 v94.49,15.24
N$44
  Top 0.254: +5V.P$14 107.14,53.38 107.31,53.21 C41.1
N$45
  Top 0.254: +12V.P$14 105.86,38.73 107.82,38.73 108.2,39.12 C34.1
N$46
  Top 0.254: R45.1 91.69,27.43 91.95,27.18 93.47,27.18 | 93.47,27.18 C38.2 | R46.2 95.25,27.18 | -12V.P$3 97.28,28.45 96.01,27.18 95.25,27.18 | 95.25,27.18 93.47,27.18
N$48
  Top 0.254: DAC1.2 14.23,33.03 13.97,32.77 13.46,32.77 13.21,32.51 R39.1
N$49
  Top 0.254: -12V.P$14 105.56,29.1 arc-90 C37.1
N$50  (via drill 0.4)
  Top 0.254: OP7.3 33.66,24.26 v33.91,24 | R39.2 13.21,29.21 | C16.1 11.43,29.46 11.68,29.21 13.21,29.21 | 13.21,29.21 v15.49,29.21
  Bottom 0.254: v33.91,24 33.66,24 31.24,26.42 28.19,26.42 26.42,28.19 16.51,28.19 v15.49,29.21
N$53
  Top 0.254: ADUM2.4 47.05,59.59 SPI_CON.10
N$54
  Top 0.254: ADUM2.5 45.78,60.87 SPI_CON.12
N$55
  Top 0.254: ADUM2.6 44.52,62.13 SPI_CON.14
N$56
  Top 0.254: SPI_CON.16 43.34,63.5 36.83,63.5 36.73,63.41 ADUM2.7
N$57
  Top 0.254: SPI_CON.13 45.9,67.75 40.83,67.75 37.75,64.67 ADUM2.8
N$58  (via drill 0.4)
  Top 0.254: DAC3.2 87.8,59.35 v86.61,58.17 | R41.1 91.95,52.07 v91.44,52.58
  Bottom 0.254: v91.44,52.58 86.61,57.4 v86.61,58.17
N$59
  Top 0.254: R41.2 95.25,52.07 95.5,51.82 95.5,50.55 | 95.5,50.55 95.5,49.28 95.25,49.02 R42.1 | C21.1 95.5,50.55
N$63
  Top 0.254: ADUM2.3 48.33,58.33 SPI_CON.8
N$69
  Top 0.254: DAC2.2 22.61,33.03 22.35,32.77 21.84,32.77 21.59,32.51 R40.1
N$70  (via drill 0.4)
  Top 0.254: v34.29,34.8 34.95,34.13 OP7.5 | C18.1 19.81,29.46 20.07,29.21 21.59,29.21 | 21.59,29.21 v23.88,29.21 | R40.2 21.59,29.21
  Bottom 0.254: v34.29,34.8 31.24,34.8 25.65,29.21 v23.88,29.21
N$71
  Top 0.254: OP9.3 88.33,47.56 88.39,47.5 91.69,47.5 | 92.3,47.24 C22.1 91.69,47.5 | R42.2 91.95,49.02 91.69,48.77 91.69,47.5
N$72  (via drill 0.4)
  Top 0.254: 43.47,3.73 SJ1.2 45.21,3.81 45.21,4.32 | 47.24,14.73 45.21,12.7 45.21,4.32 | 47.24,14.73 R11.1 | 47.24,14.73 v48.51,14.73 | C5.1 52.07,16 51.56,16.51 v51.05,16.51 | NOTCH1_IN.1 45.21,4.32
  Bottom 0.254: v51.05,16.51 50.29,16.51 v48.51,14.73
N$73  (1 unrouted)
  Top 0.254: R37.1 15.35,61.05 16.26,61.05 16.26,62.74 | R38.2 16,64.26 16.26,64.01 16.26,63.75 | 16.26,63.75 16.26,62.74 | C12.1 16.26,62.74 | ADC.3 16.32,63.82 16.26,63.75
N$74
  Top 0.254: C7.1 71.88,11.43 71.12,10.67 71.12,5.59 69.85,4.32 NOTCH2_IN.1 60.96,4.32 60.45,4.83 60.45,8.13 | SJ2.2 59.18,8.38 59.44,8.13 60.45,8.13 | 60.45,8.13 60.45,9.65 62.23,11.43 R17.1
N$75
  Top 0.254: 61.47,32 60.71,32 60.45,32.26 R27.1 | 61.47,32 61.98,32 | 63.5,32.26 R25.1 63.5,32 | COMP_IN.1 63.5,32 | 63.5,32 61.98,32 | R26.1 61.98,32 | SJ3.2 61.47,26.92 61.47,32
N$76
  Top 0.254: OP4.P$3 67.06,21.59 66.8,21.84 R49.2
N$77
  Top 0.254: OP4.P$5 67.06,19.05 66.8,18.8 R50.2
N$79
  Top 0.254: OP3.P$3 48.51,23.2 R47.1
N$80
  Top 0.254: OP3.P$5 51.05,23.2 R48.1
N$81
  Top 0.254: OP5.P$3 68.33,45.72 68.07,45.97 R51.2
N$82
  Top 0.254: 69.42,42.95 OP5.P$5 68.33,43.18 68.07,42.93 R52.2
N$83
  Top 0.254: OP5.P$10 76.71,43.18 76.96,42.93 R53.2
N$85
  Top 0.254: R33.1 81.03,20.83 78.49,23.37 SJ4.2
NOTCH1  (via drill 0.4)
  Top 0.254: OP3.P$9 52.32,31.24 52.83,31.75 v53.59,31.75 OP3.P$8 | R14.2 55.88,19.81 56.39,19.3 v56.9,19.3 | v59.18,17.78 SJ2.1
  Bottom 0.254: v53.59,31.75 55.37,31.75 59.18,27.94 59.18,19.3 | 59.18,19.3 v59.18,17.78 59.18,5.84 57.66,4.32 NOTCH1_OUT.1 | v56.9,19.3 59.18,19.3
NOTCH2  (via drill 0.4)
  Top 0.254: 73.66,24.1 OP4.P$14 74.93,24.13 | NOTCH2_OUT.1 76.45,4.32 v77.72,5.59 | 73.6,22.79 OP4.P$13 74.68,22.86 74.93,23.11 74.93,24.13 | SJ3.1 72.9,26.92 v75.69,24.13 74.93,24.13
  Bottom 0.254: v77.72,5.59 77.72,22.1 v75.69,24.13
REF  (via drill 0.4)
  Top 0.254: OP10.P$12 v14.48,48.01 OP10.P$3 | 5.08,54.1 5.08,53.09 4.57,52.58 4.13,52.58 | 5.08,54.1 C24.1 | v5.33,54.36 5.08,54.1 | 4.13,52.58 REF.6 | REF.7 3.48,52.51 3.56,52.58 4.13,52.58
  Bottom 0.254: v14.48,48.01 14.48,58.17 13.21,59.44 11.94,59.44 8.38,55.88 6.86,55.88 | 6.86,55.88 v5.33,54.36 | 6.86,55.88 5.08,57.66 VREF.P$1
SCLK_FB  (via drill 0.4)
  Top 0.254: ADC.4 23.05,63.82 23.37,63.5 v23.37,58.42 23.46,58.33 ADUM2.18 | DAC2.6 24.13,38.32 24.13,39.12 24.38,39.37 v25.65,39.37 | DAC1.6 15.75,38.32 15.75,39.12 16,39.37 v17.27,39.37
  Bottom 0.254: v17.27,39.37 18.54,38.1 24.38,38.1 v25.65,39.37 22.35,42.67 22.35,56.13 23.37,57.15 v23.37,58.42
SCLK_FF  (via drill 0.4)
  Top 0.254: DAC3.6 89.3,65.93 v90.17,66.8 | v82.55,64.77 82.45,64.67 ADUM1.18
  Bottom 0.254: v82.55,64.77 85.34,67.56 89.41,67.56 v90.17,66.8
SDI_FB  (via drill 0.4)
  Top 0.254: ADUM2.17 24.54,59.59 v24.38,59.44 | DAC1.7 15.23,39.36 16,40.13 21.59,40.13 | v21.59,42.42 21.59,40.13 | 21.59,40.13 23.11,40.13 23.62,39.62 23.62,38.31 DAC2.7
  Bottom 0.254: v24.38,59.44 22.86,59.44 21.59,58.17 v21.59,42.42
SDI_FF  (via drill 0.4)
  Top 0.254: DAC3.7 88.8,66.45 v88.9,66.55 | v83.06,63.5 82.96,63.41 ADUM1.17
  Bottom 0.254: v88.9,66.55 88.9,64.52 87.88,63.5 v83.06,63.5
SDO_ADC
  Top 0.254: ADUM2.16 25.24,60.87 23.88,62.23 23.88,64.52 23.62,64.77 ADC.5
SENS_RETURN
  Top 0.254: SENS_SIG.1 7.11,11.68 9.91,8.89 11.3,8.89 R0.P$2
SHNT_FB
  Top 0.254: 86.11,13.85 OP6.P$7 | C11.P$2 88.14,34.04 90.17,32 90.17,26.42 95.5,21.08 95.5,18.29 93.61,16.39 OP6.P$10 90.17,16.26 87.63,13.72 OP6.P$7 | OP6.P$7 85.09,13.72 84.84,13.46 84.84,10.67 84.07,9.91 SHNT.5
SHNT_FF  (via drill 0.4)
  Top 0.254: OP9.4 88.33,50.23 87.88,49.78 86.87,49.78 86.43,49.34 OP9.1 86.43,47.56 v85.34,46.48
  Bottom 0.254: v85.34,46.48 85.85,45.97 87.63,45.97 91.95,41.66 91.95,31.24 97.03,26.16 97.03,15.49 93.47,11.94 91.19,11.94 86.61,7.37 SHNT.4
V_DAC1  (via drill 0.4)
  Top 0.254: OP7.1 OP7.2 32.38,23.75 v33.15,23.24 | R5.1 v34.54,2.79
  Bottom 0.254: v34.54,2.79 34.54,6.1 35.56,7.11 35.56,10.16 33.02,12.7 33.02,23.11 v33.15,23.24
V_DAC2  (via drill 0.4)
  Top 0.254: OP7.6 OP7.7 32.38,33.66 v32.51,33.78 | R7.1 v37.59,2.79
  Bottom 0.254: v37.59,2.79 37.59,6.35 38.1,6.86 38.1,11.94 33.53,16.51 33.53,17.27 36.07,19.81 36.07,30.23 v32.51,33.78
V_REF1  (via drill 0.4)
  Top 0.254: DAC1.4 15.23,32.27 v15.75,31.75 | DAC2.4 23.61,32.77 v24.38,32 | OP10.P$7 10.41,42.93 | 10.41,42.93 v10.41,41.4 | OP10.P$6 10.67,44.2 10.41,43.94 10.41,42.93
  Bottom 0.254: v15.75,31.75 16.76,32.77 | v24.38,32 23.62,32.77 16.76,32.77 | 16.76,32.77 13.21,32.77 10.41,35.56 v10.41,41.4
V_REF1_LP  (via drill 0.4)
  Top 0.254: 12.19,56.64 12.19,54.86 11.94,54.61 R43.1 | 12.19,56.64 12.19,57.91 | 12.19,57.91 12.19,58.17 11.94,58.42 C25.1 | C26.1 12.19,56.64 | OP10.P$5 10.67,45.47 v10.16,45.97 | v12.7,57.91 12.19,57.91
  Bottom 0.254: v10.16,45.97 10.16,49.02 12.7,51.56 v12.7,57.91
V_REF1A
  Top 0.254: OP10.P$1 10.41,50.55 | OP10.P$2 10.67,49.28 10.41,49.53 10.41,50.55 | R43.2 8.64,54.61 8.38,54.36 8.38,52.07 8.64,51.82 10.16,51.82 10.41,51.56 10.41,50.55
V_REF2  (via drill 0.4)
  Top 0.254: DAC3.4 88.8,58.32 87.88,57.4 85.6,57.4 | 85.6,57.4 C20.1 | 85.6,57.4 85.6,56.39 83.82,54.61 80.26,54.61 77.22,51.56 v76.71,51.56 | OP10.P$8 18.29,42.93 18.54,43.18 18.54,44.2 | 18.54,44.2 OP10.P$9 | 18.54,44.2 19.05,44.2 21.84,46.99 21.84,49.28 v23.11,50.55
  Bottom 0.254: v76.71,51.56 26.42,51.56 25.4,50.55 v23.11,50.55
V_REF2_LP  (via drill 0.4)
  Top 0.254: C27.1 16.76,58.42 16.51,58.17 16.51,57.91 | R44.1 16.76,54.61 16.51,54.86 16.51,56.64 | 16.51,56.64 16.51,57.91 | OP10.P$10 18.54,45.47 v19.05,45.97 | C28.1 16.51,56.64 | v16,57.91 16.51,57.91
  Bottom 0.254: v19.05,45.97 19.05,51.56 16,54.61 v16,57.91
V_REFBUF1
  Top 0.254: OP10.P$13 18.29,49.28 18.54,49.53 18.54,50.55 | 18.54,50.55 18.54,51.56 18.8,51.82 20.07,51.82 20.32,52.07 20.32,54.36 20.07,54.61 R44.2 | OP10.P$14 18.54,50.55

## Text on the board
tPlace: Current stabiliser / main v4 / BM Jul 2016 | COMP | IN | OUT | + 0 - | NOTCH2 | IN | NOTCH1 | OUT | IN | OUT